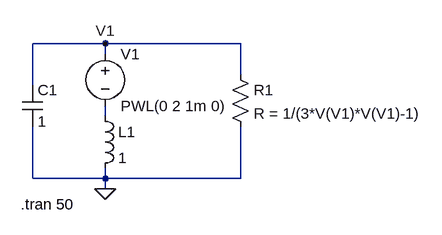
[diagram p0: schematic Circuito.asc]
Circuito.asc, the LTspice schematic file:
Version 4
SHEET 1 880 680
WIRE 160 48 48 48
WIRE 368 48 160 48
WIRE 160 64 160 48
WIRE 368 96 368 48
WIRE 48 112 48 48
WIRE 160 160 160 144
WIRE 48 256 48 176
WIRE 160 256 160 240
WIRE 160 256 48 256
WIRE 368 256 368 176
WIRE 368 256 160 256
WIRE 160 272 160 256
FLAG 160 272 0
FLAG 160 48 V1
SYMBOL cap 32 112 R0
SYMATTR InstName C1
SYMATTR Value 1
SYMBOL ind 144 144 R0
SYMATTR InstName L1
SYMATTR Value 1
SYMBOL voltage 160 48 R0
WINDOW 123 0 0 Left 0
WINDOW 39 0 0 Left 0
SYMATTR InstName V1
SYMATTR Value PWL(0 2 1m 0)
SYMBOL res 352 80 R0
SYMATTR InstName R1
SYMATTR Value R = 1/(3*V(V1)*V(V1)-1)
TEXT 30 296 Left 2 !.tran 50

The netlist it stands for:
* Circuito.asc
C1 V1 0 1
L1 N001 0 1
V1 V1 N001 PWL(0 2 1m 0)
R1 V1 0 R = 1/(3*V(V1)*V(V1)-1)
.tran 50
.backanno
.end